# EasyEDA Pro project MSDR_EzEdaPro.eprj, board PCB1_1
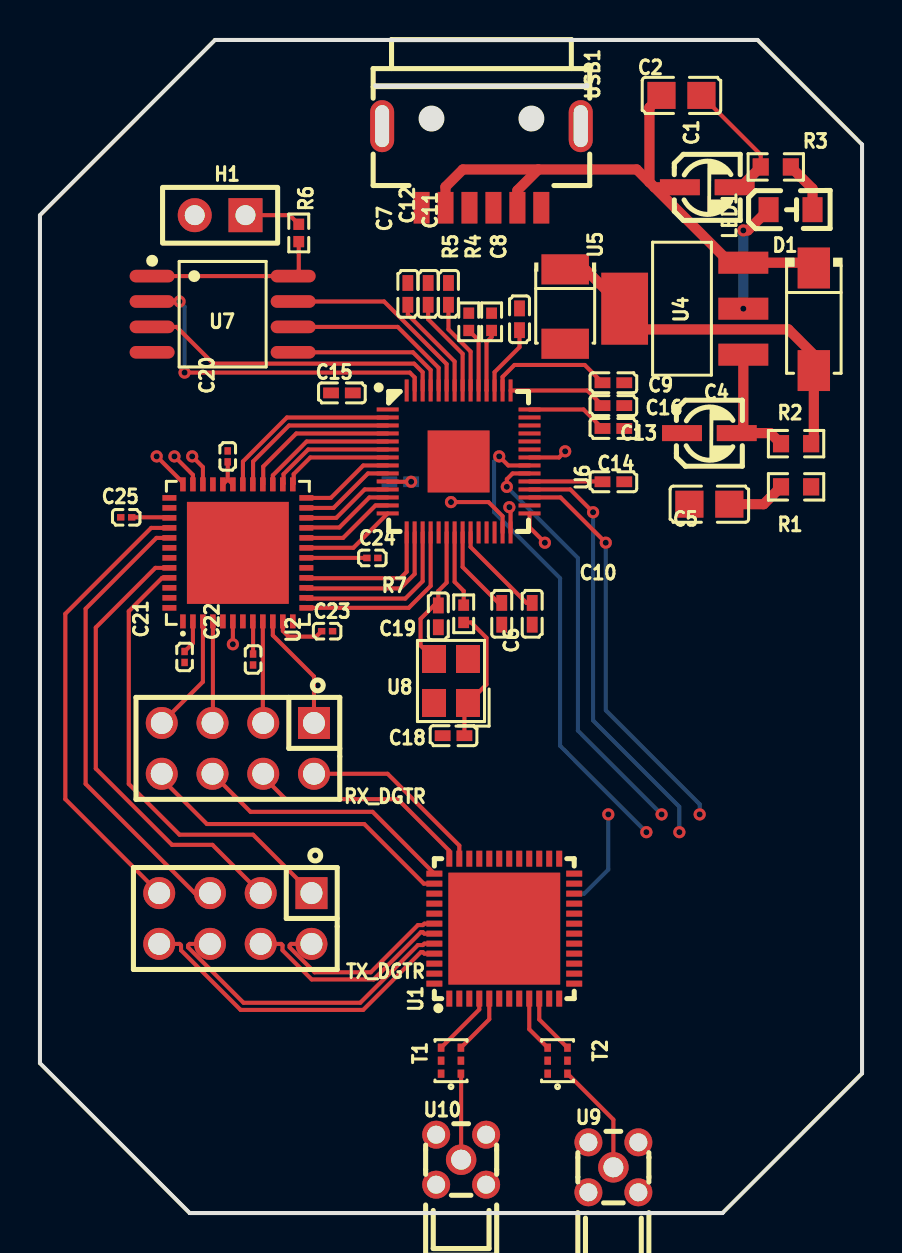
[diagram p2: board, top side]
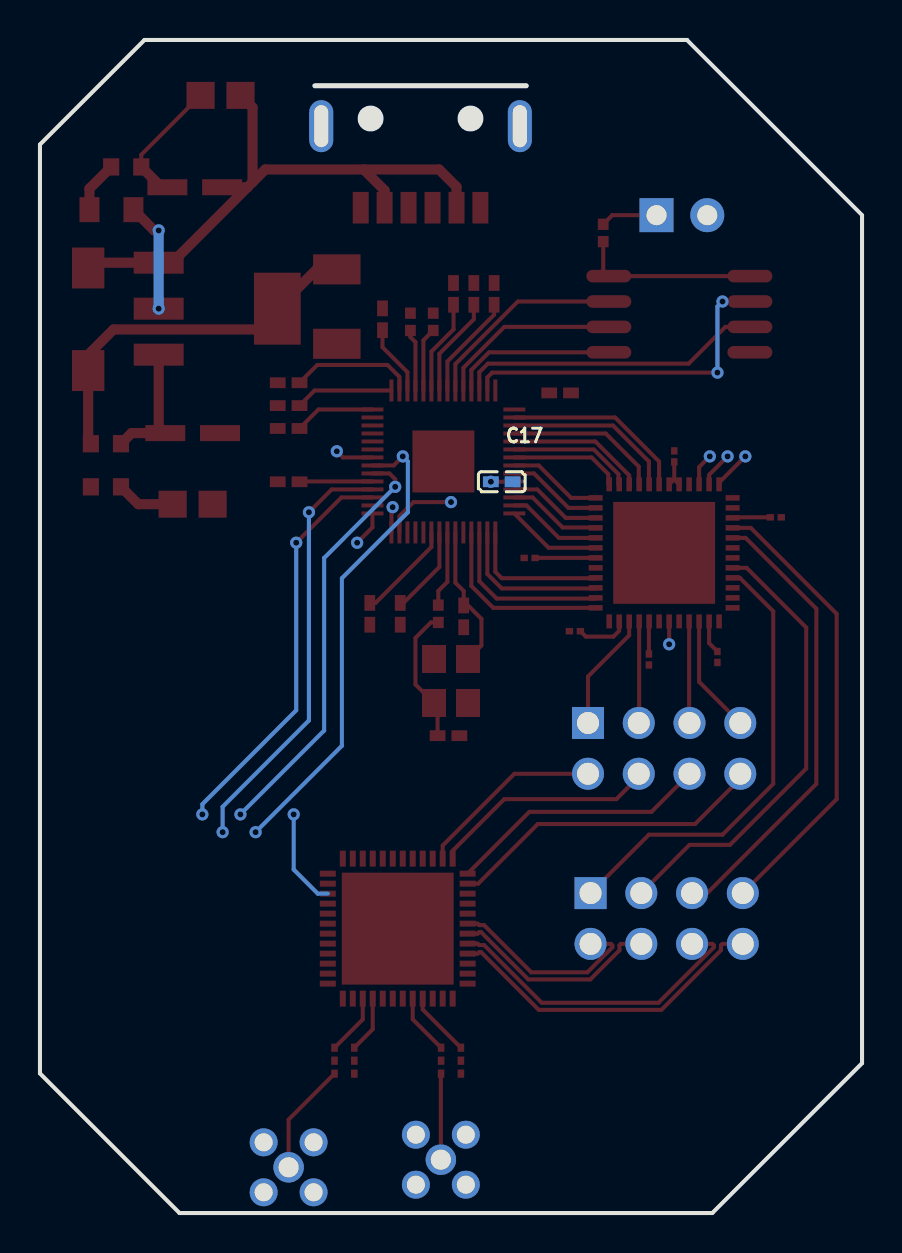
[diagram p3: board, bottom side, seen from below]

Outline 41.15 x 58.67 mm; copper layers: Top Layer, GND, 3.3v, Inner3, Inner4, Bottom Layer. Coordinates in mm from the lower left corner of the outline.
Outline path: 0,49.91 8.76,58.67 35.92,58.67 41.15,53.45 41.15,6.98 34.16,0 7.49,0 0,7.49 0,49.91
Stack: Top Layer 0.035mm 外层铜厚1oz / Dielectric1 0.0994mm 3313 RC57% 4.2mil / GND 0.0152mm 内层铜厚 / Dielectric2 0.55mm 0.55mm H/H不含铜 / 3.3v 0.0152mm 内层铜厚 / Dielectric3 0.1088mm 2116 RC54% 4.9mil / Inner3 0.0152mm 内层铜厚 / Dielectric4 0.55mm 0.55mm H/H不含铜 / Inner4 0.0152mm 内层铜厚 / Dielectric5 0.0994mm 3313 RC57% 4.2mil / Bottom Layer 0.035mm 外层铜厚1oz

## Design rules (mm)
net USBC_DN: DP1
net USBC_DP: DP1
net $1N5044: DP2
net $1N5070: DP2
net TR_RXBBQN: TR_RXBBQ
net TR_RXBBQP: TR_RXBBQ
net TR_RXBBIN: TR_RXBBI
net TR_RXBBIP: TR_RXBBI
net RX_BBCIP: RX_BBCI
net RX_BBCIN: RX_BBCI
net RX_BBCQN: RX_BBCQ
net RX_BBCQP: RX_BBCQ
net BBC_QN: BBC_Q
net BBC_QP: BBC_Q
net BBC_IN: BBC_I
net BBC_IP: BBC_I
net TR_TXBBQN: TR_TXBBQ
net TR_TXBBQP: TR_TXBBQ
net TR_TXBBIN: TR_TXBBI
net TR_TXBBIP: TR_TXBBI
net RXP: RX
net RXN: RX
net TXP: TX
net TXN: TX
template: JLCPCB Capability(Two Layers Board)
spacing copperThickness1oz (default): track to track 0.102, other pairs 0.152 to 0.3
spacing copperThickness2oz: track to track 0.203, other pairs 0.152 to 0.3
track width copperThickness1oz (default): min 0.127, default 0.254, max 2.54
track width copperThickness2oz: min 0.203, default 0.254, max 2.54
differential pair differentialPair (default): width min 0.127, default 0.254, max 2.54; gap min 0.152, default 0.152
via viaSize (default): diameter min 0.5, default 0.61, max 10; hole min 0.3, default 0.305, max 6.3

## Placement (name value [footprint] x y rotation side)
C1  10uF  [CAP-SMD_BD3.0-L3.3-W3.3-RD]  33.4 51.31 180 top
C2  100nF  [C0805]  32.11 55.9 0 top
C4  10uF  [CAP-SMD_BD3.0-L3.3-W3.3-RD]  33.51 39.01 180 top
C5  100nF  [C0805]  33.51 35.45 0 top
C6  100nF  [C0402]  24.64 29.97 90 top
C7  100nF  [C0402]  18.41 45.97 270 top
C8  1uF  [C0402]  24 44.7 270 top
C9  1uF  [C0402]  28.7 41.53 180 top
C10  100nF  [C0402]  23.11 29.97 90 top
C11  100nF  [C0402]  20.45 45.97 270 top
C12  100nF  [C0402]  19.43 45.97 270 top
C13  100nF  [C0402]  28.7 39.24 180 top
C14  100nF  [C0402]  28.7 36.58 180 top
C15  100nF  [C0402]  15.11 41.02 0 top
C16  100nF  [C0402]  28.7 40.39 180 top
C17  100nF  [C0402]  18.03 36.58 0 bottom
C18  15p  [C0402]  20.7 23.88 0 top
C19  15p  [C0402]  19.94 29.84 270 top
C20  100nF  [C0201]  9.4 37.85 270 top
C21  100nF  [C0201]  7.24 27.81 270 top
C22  100nF  [C0201]  10.67 27.69 270 top
C23  100nF  [C0201]  14.37 29.1 0 top
C24  100nF  [C0201]  16.64 32.77 0 top
C25  100nF  [C0201]  4.32 34.8 180 top
D1  -  [SMA_L4.4-W2.8-LS5.4-RD]  38.74 44.7 270 top
H1  -  [HDR-TH_2P-P2.54-V-F]  9.02 49.91 180 top
LED1  -  [LED0805-RD_GREEN]  37.57 50.19 0 top
R1  10K  [R0603]  37.85 36.32 0 top
R2  10K  [R0603]  37.85 38.48 180 top
R3  10K  [R0603]  36.83 52.32 180 top
R4  10K  [R0402]  22.61 44.58 270 top
R5  10K  [R0402]  21.46 44.58 270 top
R6  1k  [R0402]  12.95 49.02 90 top
R7  10K  [R0402]  21.21 29.97 90 top
RX_DGTR  -  [HDR-TH_8P-P2.54-V-F-R2-C4-S2.54-1]  9.91 23.24 180 top
T1  BD0922J75100AHF  [XFMR-SMD_6P-L2.1-W1.3-P0.65-BL]  20.57 7.62 90 top
T2  BD0922J75100AHF  [XFMR-SMD_6P-L2.1-W1.3-P0.65-BL]  25.91 7.62 90 top
TX_DGTR  -  [HDR-TH_8P-P2.54-V-F-R2-C4-S2.54-1]  9.78 14.73 180 top
U1  MAX2831ETM+T  [TQFN-48_L7.0-W7.0-P0.50-TL-EP5.6]  23.24 14.22 90 top
U2  MAX5864ETM+  [QFN-48_L7.0-W7.0-P0.50-BL-EP5.1]  9.91 33.02 0 top
U4  AMS1117-3.3  [SOT-223-3_L6.5-W3.4-P2.30-LS7.0-BR]  32.24 45.23 0 top
U5  22uF  [CASE-B_3528]  26.29 45.34 270 top
U6  RP2040  [LQFN-56_L7.0-W7.0-P0.4-EP]  20.96 37.59 0 top
U7  W25Q128JVSIQ  [SOIC-8_L5.3-W5.3-P1.27-LS8.0-BL]  9.14 44.96 270 top
U8  ABM8-272-T3  [CRYSTAL-SMD_4P-L3.2-W2.5-BL]  20.57 26.61 90 top
U9  BWMMCX-KWE  [MMCX-TH_DL-MMCX-KWE]  28.7 2.29 0 top
U10  BWMMCX-KWE  [MMCX-TH_DL-MMCX-KWE]  21.08 2.67 0 top
USB1  USBC-0032IPX8-00  [TYPE-C-USB-SMD_USBC-0032IPX8-00]  22.1 52.32 180 top

## Footprints (pads in the part's own frame, mm; a bottom-side part is the same pattern mirrored in y, then rotated)
C0201
  rect 0.368x0.324 smd: 1(-0.275,0) 2(0.275,0)
C0402
  rect 0.79x0.54 smd: 1(-0.545,0) 2(0.545,0)
C0805
  rect 1.41x1.35 smd: 1(-1,0) 2(1,0)
CAP-SMD_BD3.0-L3.3-W3.3-RD
  rect 2x0.8 smd: 1(1.37,0) 2(-1.37,0)
CASE-B_3528
  rect 1.506x2.376 smd: 1(-1.861,0) 2(1.861,0)
CRYSTAL-SMD_4P-L3.2-W2.5-BL
  rect 1.4x1.2 smd: 1(-1.1,-0.85) 2(1.1,-0.85) 3(1.1,0.85) 4(-1.1,0.85)
HDR-TH_2P-P2.54-V-F
  rect 1.7x1.7 hole 1: 1(-1.27,0)
  round 1.7 hole 1: 2(1.27,0)
HDR-TH_8P-P2.54-V-F-R2-C4-S2.54-1
  rect 1.6x1.6 hole 1.1: 1(-3.81,-1.27)
  round 1.6 hole 1.1: 2(-3.81,1.27) 3(-1.27,-1.27) 4(-1.27,1.27) 5(1.27,-1.27) 6(1.27,1.27) 7(3.81,-1.27) 8(3.81,1.27)
LED0805-RD_GREEN
  rect 1x1.25 smd: 1(-1.1,0) 2(1.1,0)
LQFN-56_L7.0-W7.0-P0.4-EP
  rect 1.1x0.2 smd: 1(-3.55,2.6) 2(-3.55,2.2) 3(-3.55,1.8) 4(-3.55,1.4) 5(-3.55,1) 6(-3.55,0.6) 7(-3.55,0.2) 8(-3.55,-0.2) 9(-3.55,-0.6) 10(-3.55,-1) 11(-3.55,-1.4) 12(-3.55,-1.8) 13(-3.55,-2.2) 14(-3.55,-2.6) 29(3.55,-2.6) 30(3.55,-2.2) 31(3.55,-1.8) 32(3.55,-1.4) 33(3.55,-1) 34(3.55,-0.6) 35(3.55,-0.2) 36(3.55,0.2) 37(3.55,0.6) 38(3.55,1) 39(3.55,1.4) 40(3.55,1.8) 41(3.55,2.2) 42(3.55,2.6)
  rect 0.2x1.1 smd: 15(-2.6,-3.55) 16(-2.2,-3.55) 17(-1.8,-3.55) 18(-1.4,-3.55) 19(-1,-3.55) 20(-0.6,-3.55) 21(-0.2,-3.55) 22(0.2,-3.55) 23(0.6,-3.55) 24(1,-3.55) 25(1.4,-3.55) 26(1.8,-3.55) 27(2.2,-3.55) 28(2.6,-3.55) 43(2.6,3.55) 44(2.2,3.55) 45(1.8,3.55) 46(1.4,3.55) 47(1,3.55) 48(0.6,3.55) 49(0.2,3.55) 50(-0.2,3.55) 51(-0.6,3.55) 52(-1,3.55) 53(-1.4,3.55) 54(-1.8,3.55) 55(-2.2,3.55) 56(-2.6,3.55)
  rect 3.1x3.1 smd: 57(0,0)
MMCX-TH_DL-MMCX-KWE
  round 1.524 hole 1: 1(0,0)
  round 1.4 hole 0.9: 2(-1.25,1.25) 3(-1.25,-1.25) 4(1.25,-1.25) 5(1.25,1.25)
QFN-48_L7.0-W7.0-P0.50-BL-EP5.1
  rect 0.28x0.7 smd: 1(-2.75,-3.428) 2(-2.25,-3.428) 3(-1.75,-3.428) 4(-1.25,-3.428) 5(-0.75,-3.428) 6(-0.25,-3.428) 7(0.25,-3.428) 8(0.75,-3.428) 9(1.25,-3.428) 10(1.75,-3.428) 11(2.25,-3.428) 12(2.75,-3.428) 25(2.75,3.428) 26(2.25,3.428) 27(1.75,3.428) 28(1.25,3.428) 29(0.75,3.428) 30(0.25,3.428) 31(-0.25,3.428) 32(-0.75,3.428) 33(-1.25,3.428) 34(-1.75,3.428) 35(-2.25,3.428) 36(-2.75,3.428)
  rect 0.7x0.28 smd: 13(3.428,-2.75) 14(3.428,-2.25) 15(3.428,-1.75) 16(3.428,-1.25) 17(3.428,-0.75) 18(3.428,-0.25) 19(3.428,0.25) 20(3.428,0.75) 21(3.428,1.25) 22(3.428,1.75) 23(3.428,2.25) 24(3.428,2.75) 37(-3.428,2.75) 38(-3.428,2.25) 39(-3.428,1.75) 40(-3.428,1.25) 41(-3.428,0.75) 42(-3.428,0.25) 43(-3.428,-0.25) 44(-3.428,-0.75) 45(-3.428,-1.25) 46(-3.428,-1.75) 47(-3.428,-2.25) 48(-3.428,-2.75)
  rect 5.1x5.1 smd: 49(0,0)
R0402
  rect 0.566x0.54 smd: 1(-0.433,0) 2(0.433,0)
R0603
  rect 0.806x0.864 smd: 1(-0.753,0) 2(0.753,0)
SMA_L4.4-W2.8-LS5.4-RD
  rect 2.046x1.62 smd: 1(-2.566,0) 2(2.566,0)
SOIC-8_L5.3-W5.3-P1.27-LS8.0-BL
  oval 0.63x2.25 smd: 1(-1.905,-3.53) 2(-0.635,-3.53) 3(0.635,-3.53) 4(1.905,-3.53) 5(1.905,3.53) 6(0.635,3.53) 7(-0.635,3.53) 8(-1.905,3.53)
SOT-223-3_L6.5-W3.4-P2.30-LS7.0-BR
  rect 2.5x1.1 smd: 1(2.97,-2.3) 2(2.97,0) 3(2.97,2.3)
  rect 2.34x3.6 smd: 4(-2.97,0)
TQFN-48_L7.0-W7.0-P0.50-TL-EP5.6
  rect 0.8x0.3 smd: 1(-3.5,2.751) 2(-3.5,2.251) 3(-3.5,1.75) 4(-3.5,1.251) 5(-3.5,0.75) 6(-3.5,0.252) 7(-3.5,-0.249) 8(-3.5,-0.75) 9(-3.5,-1.25) 10(-3.5,-1.75) 11(-3.5,-2.249) 12(-3.5,-2.748) 25(3.5,-2.748) 26(3.5,-2.249) 27(3.5,-1.75) 28(3.5,-1.25) 29(3.5,-0.75) 30(3.5,-0.249) 31(3.5,0.252) 32(3.5,0.75) 33(3.5,1.251) 34(3.5,1.75) 35(3.5,2.251) 36(3.5,2.751)
  rect 0.3x0.8 smd: 13(-2.751,-3.5) 14(-2.251,-3.5) 15(-1.75,-3.5) 16(-1.25,-3.5) 17(-0.75,-3.5) 18(-0.251,-3.5) 19(0.249,-3.5) 20(0.75,-3.5) 21(1.25,-3.5) 22(1.75,-3.5) 23(2.251,-3.5) 24(2.751,-3.5) 37(2.751,3.5) 38(2.251,3.5) 39(1.75,3.5) 40(1.25,3.5) 41(0.75,3.5) 42(0.251,3.5) 43(-0.251,3.5) 44(-0.75,3.5) 45(-1.25,3.5) 46(-1.75,3.5) 47(-2.251,3.5) 48(-2.751,3.5)
  rect 5.6x5.6 smd: 49(0,0.001)
TYPE-C-USB-SMD_USBC-0032IPX8-00
  oval 1.2x2.6 hole 0.7x2.1: 7(-4.97,-2.04) 7(4.97,-2.04)
  rect 0.8x1.58 smd: A5(-0.6,2.04) A9(1.8,2.04) A12(2.995,2.04) B5(0.6,2.04) B9(-1.8,2.04) B12(-2.995,2.04)
XFMR-SMD_6P-L2.1-W1.3-P0.65-BL
  rect 0.41x0.33 smd: 1(-0.65,-0.495) 2(0,-0.495) 3(0.65,-0.495) 4(0.65,0.495) 5(0,0.495) 6(-0.65,0.495)

## Nets
As in the schematic, except:
1.1V: C6.2 C7.2 C8.2 U6.23 U6.45 U6.50
3.3V: C9.2 C10.2 C11.2 C12.2 C13.2 C14.2 C15.2 C16.2 C17.2 C20.1 D1.2 R2.1 R6.1 U1.1 U1.7 U1.13 U1.17 U1.20 U1.25 U1.27 U1.30 U1.39 U1.41 U1.46 U2.33 U4.4 U5.1 U6.1 U6.10 U6.22 U6.33 U6.42 U6.43 U6.44 U6.48 U6.49 U6.56 U7.1 U7.8
GND: C1.2 C2.2 C4.1 C5.1 C6.1 C7.1 C8.1 C9.1 C10.1 C11.1 C12.1 C13.1 C14.1 C15.1 C16.1 C17.1 C18.1 C19.2 C21.2 C22.2 C23.2 C24.2 C25.2 H1.2 R1.2 R3.2 U1.2 U1.26 U1.31 U1.47 U2.5 U2.7 U2.12 U2.17 U2.37 U2.42 U2.47 U5.2 U6.19 U6.57 U7.4 U8.2 U8.4 USB1.A12 USB1.B12
$1N4821: C20.2 U2.31 U2.32

Pads without a net: T1 2 5 6; T2 2 5 6; U1 3 6 8 11 14 23 24 28 29 32 33 34 40 49; U2 1 38 43 46 48 49; U6 24 25 26 37 38; U9 2 3 4 5; U10 2 3 4 5; USB1 7

## Via types
v1: diameter 0.61, hole 0.305, Top Layer to Bottom Layer, 22 vias

## Routing (per net, layer and track width the routed paths; a pad name or vN(x,y) marks a point on that pad's centre or on a via; arc(x,y) is an arc through that point)
1.1V: length 13.8
  Top Layer w0.203: U6.23 21.56,33.31 24.35,30.52 C6.2 ; U6.50 20.75,42.59 18.41,44.93 C7.2 ; U6.45 22.75,42.06 24,43.31 C8.2
3.3V: length 62.2
  Top Layer w0.203: C10.2 22.95,30.52 21.16,32.31 U6.22 ; U7.1 U7.8 12.95,47.14 R6.1 ; C11.2 20.45,44.2 21.56,43.09 U6.48 ; C12.2 19.43,44.7 21.16,42.98 U6.49 ; C9.2 27.27,42.42 23.75,42.42 23.16,41.82 U6.44 ; 24.5,36.59 28.14,36.59 C14.2 ; C13.2 27.21,40.19 24.5,40.19 ; U6.43 27.4,41.14 C16.2 ; U6.10 17.42,36.58 v1(18.58,36.58)
  Top Layer w0.508: R2.1 38.74,38.62 D1.2 38.74,42.93 37.47,44.2 30.3,44.2 U4.4 27.28,47.22 26.01,47.22
+5V: length 30.1
  Top Layer w0.508: 30.76,51.31 34.53,47.53 U4.3 38.47,47.53 D1.1 ; 30.76,51.31 C1.1 ; 30.76,51.31 30.51,51.56 ; 24.94,52.2 23.9,51.15 USB1.B9 ; 24.94,52.2 29.87,52.2 30.51,51.56 ; 24.94,52.2 21.17,52.2 20.3,51.33 USB1.A9 ; C2.1 30.51,55.3 30.51,51.56
GND: length 6.5
  Top Layer w0.203: C2.2 36.08,52.93 R3.2
  Top Layer w0.508: R3.2 35.06,51.31 C1.2
BBC_CLK: length 27.6
  Top Layer w0.203: U2.6 v1(9.66,28.45) ; v1(26.29,38.1) 25.98,37.79 24.5,37.79
  Inner4 w0.203: v1(26.29,38.1) 24.38,40 17.27,40 9.66,32.39 v1(9.66,28.45)
BBC_CS: length 29.4
  Top Layer w0.203: U2.36 7.16,36.53 v1(5.84,37.85) ; 24.5,34.99 24.5,34.3 v1(25.27,33.53)
  Inner3 w0.203: v1(5.84,37.85) 7.62,39.62 23.5,39.62 25.78,37.34 25.78,34.04 v1(25.27,33.53)
BBC_DA0: length 9.4
  Top Layer w0.203: U6.18 19.56,31.37 18.46,30.27 U2.13
BBC_DA1: length 8.6
  Top Layer w0.203: U2.14 13.37,30.73 18.29,30.73 19.16,31.6 U6.17
BBC_DA2: length 7.8
  Top Layer w0.203: U2.15 13.36,31.24 18.03,31.24 18.75,31.96 U6.16
BBC_DA3: length 7.1
  Top Layer w0.203: U2.16 13.35,31.75 18.03,31.75 18.35,32.07 U6.15
BBC_DA4: length 4.8
  Top Layer w0.203: U2.19 13.34,33.27 15.69,33.27 U6.14
BBC_DA5: length 4.7
  Top Layer w0.203: U2.20 15.17,33.77 16.8,35.39 U6.13
BBC_DA6: length 4.7
  Top Layer w0.203: U6.12 16.49,35.79 14.99,34.29 13.35,34.29 U2.21
BBC_DA7: length 4.7
  Top Layer w0.203: U6.11 16.25,36.19 14.83,34.77 U2.22
BBC_DD0: length 4.8
  Top Layer w0.203: U6.9 16.42,36.99 14.7,35.27 U2.23
BBC_DD1: length 4.7
  Top Layer w0.203: U2.24 14.56,35.77 16.18,37.39 U6.8
BBC_DD2: length 5.6
  Top Layer w0.203: U6.7 13.53,37.79 12.7,36.96 12.7,36.49 U2.25
BBC_DD3: length 6.2
  Top Layer w0.203: U6.6 13.43,38.19 12.19,36.96 12.19,36.48 U2.26
BBC_DD4: length 6.9
  Top Layer w0.203: U6.5 13.35,38.59 11.66,36.9 U2.27
BBC_DD5: length 7.8
  Top Layer w0.203: U2.28 11.18,36.47 11.18,37.34 12.83,38.99 U6.4
BBC_DD6: length 8.6
  Top Layer w0.203: U6.3 12.47,39.39 10.67,37.59 10.67,36.46 U2.29
BBC_DD7: length 9.3
  Top Layer w0.203: U2.30 10.16,36.45 10.16,37.59 12.36,39.79 U6.2
BBC_DIN: length 19.8
  Top Layer w0.203: U6.27 23.16,34.86 22.45,35.56 v1(20.57,35.56) ; U2.34 8.16,37.31 v1(7.62,37.85)
  Inner3 w0.203: v1(7.62,37.85) 8.38,38.61 17.53,38.61 v1(20.57,35.56)
BBC_IN: length 22.8
  Top Layer w0.203: TX_DGTR.3 8.64,18.41 6.61,18.41 2.79,22.23 2.79,29.29 5.78,32.27 U2.44
BBC_IP: length 22.8
  Top Layer w0.203: U2.45 6.12,31.77 4.44,30.1 4.44,21.46 6.99,18.92 10.67,18.92 TX_DGTR.1
BBC_QN: length 22.9
  Top Layer w0.203: U2.40 5.57,34.27 1.27,29.97 1.27,20.7 TX_DGTR.7
BBC_QP: length 22.9
  Top Layer w0.203: TX_DGTR.5 7.75,16 2.29,21.46 2.29,30.23 5.83,33.77 U2.41
BBC_SCLK: length 21.9
  Top Layer w0.203: v1(23.5,35.31) 23.56,35.25 U6.28 ; U2.35 7.66,36.92 v1(6.73,37.85)
  Inner3 w0.203: v1(23.5,35.31) 19.69,39.12 8,39.12 v1(6.73,37.85)
PLL_LOCK: length 23
  Inner3 w0.203: 29.34,37.59 29.34,20.83 v1(28.45,19.94)
  Bottom Layer w0.203: U1.22 27.24,15.97 28.45,17.18 v1(28.45,19.94)
RX_BBCIN: length 5.1
  Top Layer w0.203: RX_DGTR.5 8.66,24.53 U2.4
RX_BBCIP: length 5.9
  Top Layer w0.203: RX_DGTR.7 8.16,26.57 U2.3
RX_BBCQN: length 5.1
  Top Layer w0.203: RX_DGTR.3 11.16,24.53 U2.9
RX_BBCQP: length 5.9
  Top Layer w0.203: U2.10 11.66,28.89 13.72,26.83 RX_DGTR.1
RXN: length 3
  Top Layer w0.203: 21.07,8.27 22.49,9.69 U1.5
RXP: length 3.2
  Top Layer w0.203: T1.4 21.99,10.18 U1.4
TR_CLKOUT: length 29.8
  Top Layer w0.203: v1(22.99,37.85) 23.44,37.39 24.5,37.39
  Inner3 w0.203: v1(30.35,19.05) 30.35,17.4 28.43,15.47 U1.21
  Bottom Layer w0.203: v1(30.35,19.05) 26.03,23.37 26.03,31.75 22.73,35.05 22.73,37.59 v1(22.99,37.85)
TR_CS#: length 31.5
  Top Layer w0.203: v1(28.32,33.53) 26.06,35.79 24.5,35.79
  Inner3 w0.203: v1(33.02,19.94) 33.02,16.76 28.73,12.47 U1.15
  Bottom Layer w0.203: v1(28.32,33.53) 28.32,25.15 33.02,20.45 v1(33.02,19.94)
TR_DIN: length 29.6
  Top Layer w0.203: 24.5,36.99 23.66,36.99 23.37,36.7 v1(23.37,36.32)
  Inner3 w0.203: U1.19 28.57,14.47 31.12,17.02 v1(31.12,19.94)
  Bottom Layer w0.203: v1(23.37,36.32) 26.92,32.77 26.92,24.13 v1(31.12,19.94)
TR_RXBBIN: length 13.2
  Top Layer w0.203: U1.37 16.65,20.07 10.54,20.07 RX_DGTR.6
TR_RXBBIP: length 16.1
  Top Layer w0.203: RX_DGTR.8 6.1,21.72 8.36,19.46 16.23,19.46 19.21,16.47 U1.38
TR_RXBBQN: length 9.4
  Top Layer w0.203: RX_DGTR.2 17.4,21.97 20.99,18.38 U1.35
TR_RXBBQP: length 11.4
  Top Layer w0.203: RX_DGTR.4 11.18,21.82 12.3,20.7 17.91,20.7 20.49,18.12 U1.36
TR_SCLK: length 30
  Top Layer w0.203: 24.5,36.19 26.55,36.19 v1(27.69,35.05)
  Inner3 w0.203: U1.18 26.74,13.97 28.96,13.97 32,17.02 v1(32,19.05)
  Bottom Layer w0.203: v1(32,19.05) 32,20.32 27.69,24.64 v1(27.69,35.05)
TR_TXBBIN: length 15.9
  Top Layer w0.203: TX_DGTR.6 7.49,13.46 7.42,13.39 7.42,13.29 10.19,10.52 16.03,10.52 18.92,13.4 19.17,13.4 19.24,13.47 U1.44
TR_TXBBIP: length 16.5
  Top Layer w0.203: U1.45 19.24,12.97 19.17,13.05 19.07,13.05 16.18,10.16 10.04,10.16 7.06,13.14 7.06,13.39 6.99,13.46 TX_DGTR.8
TR_TXBBQN: length 10
  Top Layer w0.203: U1.42 19.24,14.47 19.17,14.4 18.92,14.4 16.56,12.04 13.75,12.04 12.5,13.29 12.5,13.39 12.57,13.46 TX_DGTR.2
TR_TXBBQP: length 10.6
  Top Layer w0.203: U1.43 19.24,13.97 19.17,14.05 19.07,14.05 16.7,11.68 13.6,11.68 12.14,13.14 12.14,13.39 12.07,13.46 TX_DGTR.4
TXN: length 3
  Top Layer w0.203: T2.3 24.99,9.68 U1.10
TXP: length 2.8
  Top Layer w0.203: U1.9 24.49,9.19 T2.4
$1N1972: length 5.6
  Top Layer w0.508: LED1.1 35.43,49.15 v1(35.21,49.15)
  Bottom Layer w0.508: v1(35.21,45.23) v1(35.21,49.15)
$1N2144: length 9.4
  Top Layer w0.508: R2.2 36.56,39.01 C4.2 35.21,39.34 U4.1 ; R1.1 36.23,35.45 C5.2
$1N2960: length 2.6
  Top Layer w0.508: R3.1 38.67,51.24 LED1.2
$1N3442: length 3.2
  Top Layer w0.203: R5.2 21.96,43.65 U6.47
$1N3446: length 3.1
  Top Layer w0.203: R4.2 22.61,43.81 22.35,43.56 22.35,41.14 U6.46
$1N4821: length 1.6
  Top Layer w0.203: 9.4,36.69 9.41,36.69 U2.31 ; 9.4,36.69 U2.32 ; 9.4,36.69 C20.2
$1N5034: length 10.3
  Top Layer w0.203: U6.51 20.35,42.46 17.23,45.59 U7.7
$1N5044: length 15.4
  Top Layer w0.203: 5.61,44.32 6.84,44.32 8.68,42.48 18.73,42.48 19.16,42.06 U6.54
$1N5058: length 8.3
  Top Layer w0.203: U6.53 19.56,42.17 18.67,43.05 U7.5
$1N5070: length 17.3
  Top Layer w0.203: v1(6.99,45.59) U7.2 ; v1(7.24,42.04) 18.51,42.04 18.75,41.79 U6.55
  Bottom Layer w0.203: v1(7.24,42.04) 7.24,45.34 v1(6.99,45.59)
$1N5085: length 9.3
  Top Layer w0.203: U6.52 19.96,42.27 17.91,44.32 12.67,44.32
$1N5173: length 2.9
  Top Layer w0.203: H1.1 12.5,49.91 R6.2
$1N5390: length 7.3
  Top Layer w0.203: U6.20 20.35,31.53 19.94,31.11 C19.1 19.72,30.39 19.05,29.72 19.05,28.39 U8.3
$1N5565: length 6.8
  Top Layer w0.203: 21.21,29.54 21.58,29.54 22.35,28.77 22.35,26.44 U8.1 21.25,25.33 C18.2
$1N5572: length 3.8
  Top Layer w0.203: R7.2 21.21,31.11 20.75,31.57 U6.21
$1N7470: length 1.7
  Top Layer w0.203: C21.1 7.66,28.5 U2.2
$1N7508: length 1.6
  Top Layer w0.203: U2.8 10.67,29.58 C22.1
$1N7546: length 2.6
  Top Layer w0.203: U2.11 12.16,29.12 12.45,28.83 13.82,28.83 C23.1
$1N7584: length 3
  Top Layer w0.203: C24.1 16.36,32.77 16.36,32.77 U2.18
$1N7821: length 1.9
  Top Layer w0.203: U2.39 6.45,34.8 C25.1
$1N12907: length 5.6
  Top Layer w0.203: U9.1 28.7,4.67 T2.1
$1N12914: length 4.3
  Top Layer w0.203: 21.07,6.97 21.08,6.96 U10.1

## Copper pours and planes (outline as drawn; the poured copper is in the pictures)
GND on GND: 0.26,58.42 40.89,58.42 40.89,0.26 0.26,0.26
GND on GND: 28.01,1.33 29.4,1.33 29.4,0.26 28.01,0.26
GND on 3.3v: 0.26,58.42 40.89,58.42 40.89,0.26 0.26,0.26
GND on 3.3v: 28.01,1.33 29.4,1.33 29.4,0.26 28.01,0.26

Small or netless copper shapes (teardrops, artwork), in the pictures only: 4 on GND, 4 on 3.3v
